# Altium project sustentationAvecPC.PrjPCB
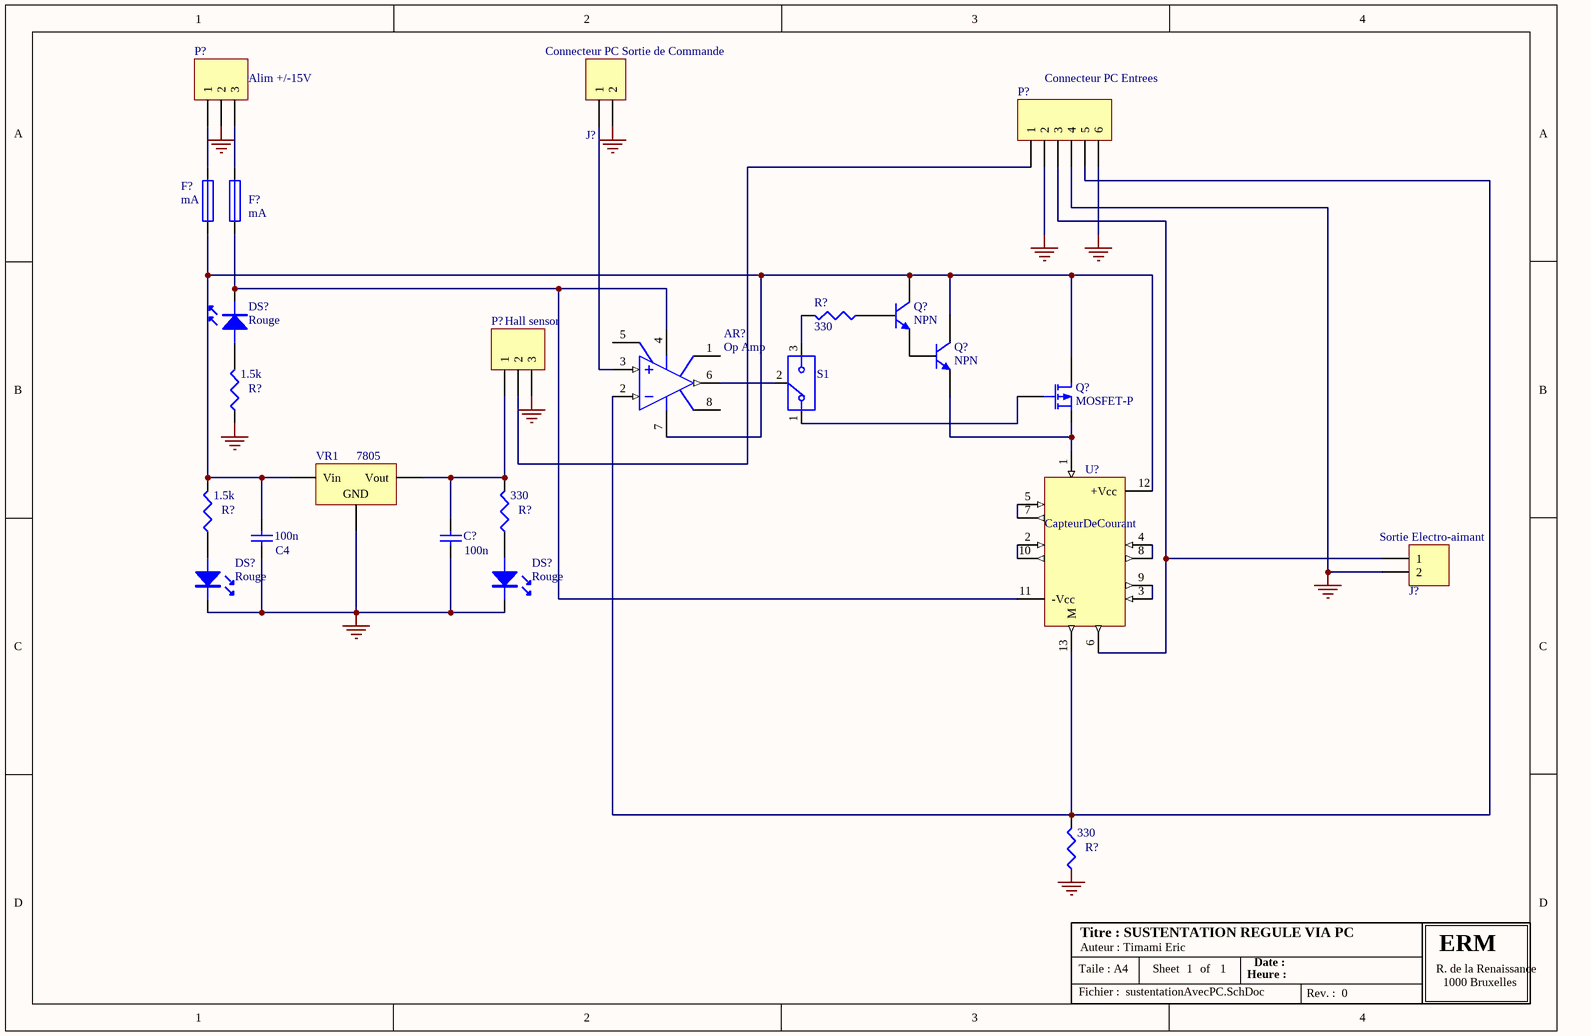
[diagram p0: sustentationAvecPC.SchDoc]
1 sheet, 24 parts. Net scope: global (net labels, ports and power ports of the same name join across sheets).

## Sheet sustentationAvecPC.SchDoc
size A4; Organization: ECAM; Revision: 0; SheetNumber: 1; SheetTotal: 1

### Parts
(Parts that share a designator on the sheet are numbered #1, #2 ... from top to bottom, then left to right.)
AR?  Op Amp  [CAN-8/D9.4]
C4  value 100n  [cap100n]  (hidden comment: Condensateur)
C?  value 100n  [Capa_100n]  (hidden comment: Condensateur)
DS?#1  Color: Rouge  [Led 0.1]  (hidden comment: LED)
DS?#2  Color: Rouge  [Led 0.1]  (hidden comment: LED)
DS?#3  Color: Rouge  [Led 0.1]  (hidden comment: LED)
F?#1  value mA  [FUSE-10]
F?#2  value mA  [FUSE-10]
J?#1  Connecteur PC Sortie de Commande  [connecteur PC Sorties command]
J?#2  Sortie Electro-aimant  [connecteur 3A]
P?#1  Alim +/-15V  [CONVIS-3]
P?#2  Connecteur PC Entrees  [HDR1X6]
P?#3  Hall sensor  [connecteur capteur Hall]
Q?#1  NPN  [BCY-W3]
Q?#2  NPN  [BCY-W3]
Q?#3  MOSFET-P  [TO-220]
R?#1  value 330  [AXIAL-0.4]  (hidden comment: Résistance)
R?#2  value 1.5k  [AXIAL-0.4]  (hidden comment: Résistance)
R?#3  value 1.5k  [AXIAL-0.4]  (hidden comment: Résistance)
R?#4  value 330  [AXIAL-0.4]  (hidden comment: Résistance)
R?#5  value 330  [AXIAL-0.4]  (hidden comment: Résistance)
S1  DIP Inverseur  [SIP3]  (value not drawn)
U?  CapteurDeCourant  [Sonde_Courant]
VR1  7805  [TO-220]

### Nets
GND: C4.2 C?.2 DS?#2.2(K) DS?#3.2(K) J?#1.2 J?#2.2 P?#1.2 P?#2.2 P?#2.4 P?#2.6 P?#3.3 R?#2.1 VR1.2(GND)
NetAR?_2: AR?.2(IN-) P?#2.5 R?#5.2 U?.13(M)
NetAR?_3: AR?.3(IN+) J?#1.1
NetAR?_4: AR?.4(V-) DS?#1.2(K) F?#2.2(F2) U?.11(-Vcc)
NetAR?_6: AR?.6(OUT) S1.2(COM)
NetAR?_7: AR?.7(V+) C4.1 F?#1.2(F2) Q?#1.1(C) Q?#2.1(C) Q?#3.1(D) R?#3.2 U?.12(+Vcc) VR1.1(Vin)
NetC?_1: C?.1 P?#3.1 R?#4.2 VR1.3(Vout)
NetDS?#1_1: DS?#1.1(A) R?#2.2
NetDS?#2_1: DS?#2.1(A) R?#3.1
NetDS?#3_1: DS?#3.1(A) R?#4.1
NetF?#1_1: F?#1.1(F1) P?#1.1
NetF?#2_1: F?#2.1(F1) P?#1.3
NetJ?#2_1: J?#2.1 P?#2.3 U?.6
NetP?#2_1: P?#2.1 P?#3.2
NetQ?#1_2: Q?#1.2(B) R?#1.1
NetQ?#1_3: Q?#1.3(E) Q?#2.2(B)
NetQ?#2_3: Q?#2.3(E) Q?#3.3(S) U?.1
NetQ?#3_2: Q?#3.2(G) S1.1(TA)
NetR?#1_2: R?#1.2 S1.3(TB)
NetU?_2: U?.2 U?.10
NetU?_3: U?.3 U?.9
NetU?_4: U?.4 U?.8
NetU?_5: U?.5 U?.7

Not connected (* = marked no-connect by the designer): AR? 1(OS_NUL) 5(OS_NUL) 8(TAB); R?#5 1

### Notes on the sheet
- Taile : A4
- Titre : SUSTENTATION REGULE VIA PC
- Auteur : Timami Eric
- Sheet
- of
- Heure :
- Date :
- R. de la Renaissance
- ERM
- 1000 Bruxelles
- Fichier :
- Rev. :
- Labels drawn without touching a wire or pin: GND

### Library data of the parts
AR? = Op Amp: FET Operational Amplifier; Published: 8-Jun-2000; LatestRevisionDate: 17-Jul-2002; LatestRevisionNote: Re-released for DXP Platform.; DatasheetDocument: REV. B; PackageReference: H-08A; Publisher: Altium Limited
F?#1 F?#2 = Fusible: Designer: ECAM 2004; Type: Fusible
J?#1 J?#2 = Connecteur 2: Connecteur; Designer: ECAM 2005; Type: Connecteur à vis
P?#1 P?#3 = connecteur 3: Header, 3-Pin; LatestRevisionDate: 17-Jul-2002; LatestRevisionNote: Re-released for DXP Platform.; Publisher: Altium Limited
P?#2 = Header 6: Header, 6-Pin; LatestRevisionDate: 17-Jul-2002; LatestRevisionNote: Re-released for DXP Platform.; Publisher: Altium Limited
Q?#1 Q?#2 = NPN: NPN Bipolar Transistor; Published: 8-Jun-2000; LatestRevisionDate: 17-Jul-2002; LatestRevisionNote: Re-released for DXP Platform.; Publisher: Altium Limited; Code_JEDEC: TO-226-AA
Q?#3 = MOSFET-P: P-Channel MOSFET; Published: 8-Jun-2000; LatestRevisionDate: 17-Jul-2002; LatestRevisionNote: Re-released for DXP Platform.; Publisher: Altium Limited
R?#1-R?#5 = Résistance: Résistance standard; Designer: ECAM 2005; Type: Résistance standard
S1 = DIP Inverseur: Inverseur; Supplier: Farnell 674 345; Designer: ECAM 2003; Type: Switch slide SPDT vertical
VR1 = Volt Reg: Voltage Regulator; Published: 24-Mar-1999; LatestRevisionDate: 17-Jul-2002; LatestRevisionNote: Re-released for DXP Platform.; Publisher: Altium Limited; Code_JEDEC: SMD-220
C4 C? = Condensateur: Supplier: Farnell; Designer: ECAM 2004
DS?#1-DS?#3 = LED: Designer: ECAM 2004; Type: LED
U? = CapteurDeCourant: Published: 8-Jun-2000; LatestRevisionDate: 17-Jul-2002; LatestRevisionNote: Re-released for DXP Platform.; DatasheetDocument: Jul-1996; PackageDocument: Jan-1998; PackageReference: D016; Publisher: Altium Limited